# EAGLE schematic ESP Updater (EAGLE 9.6.2)
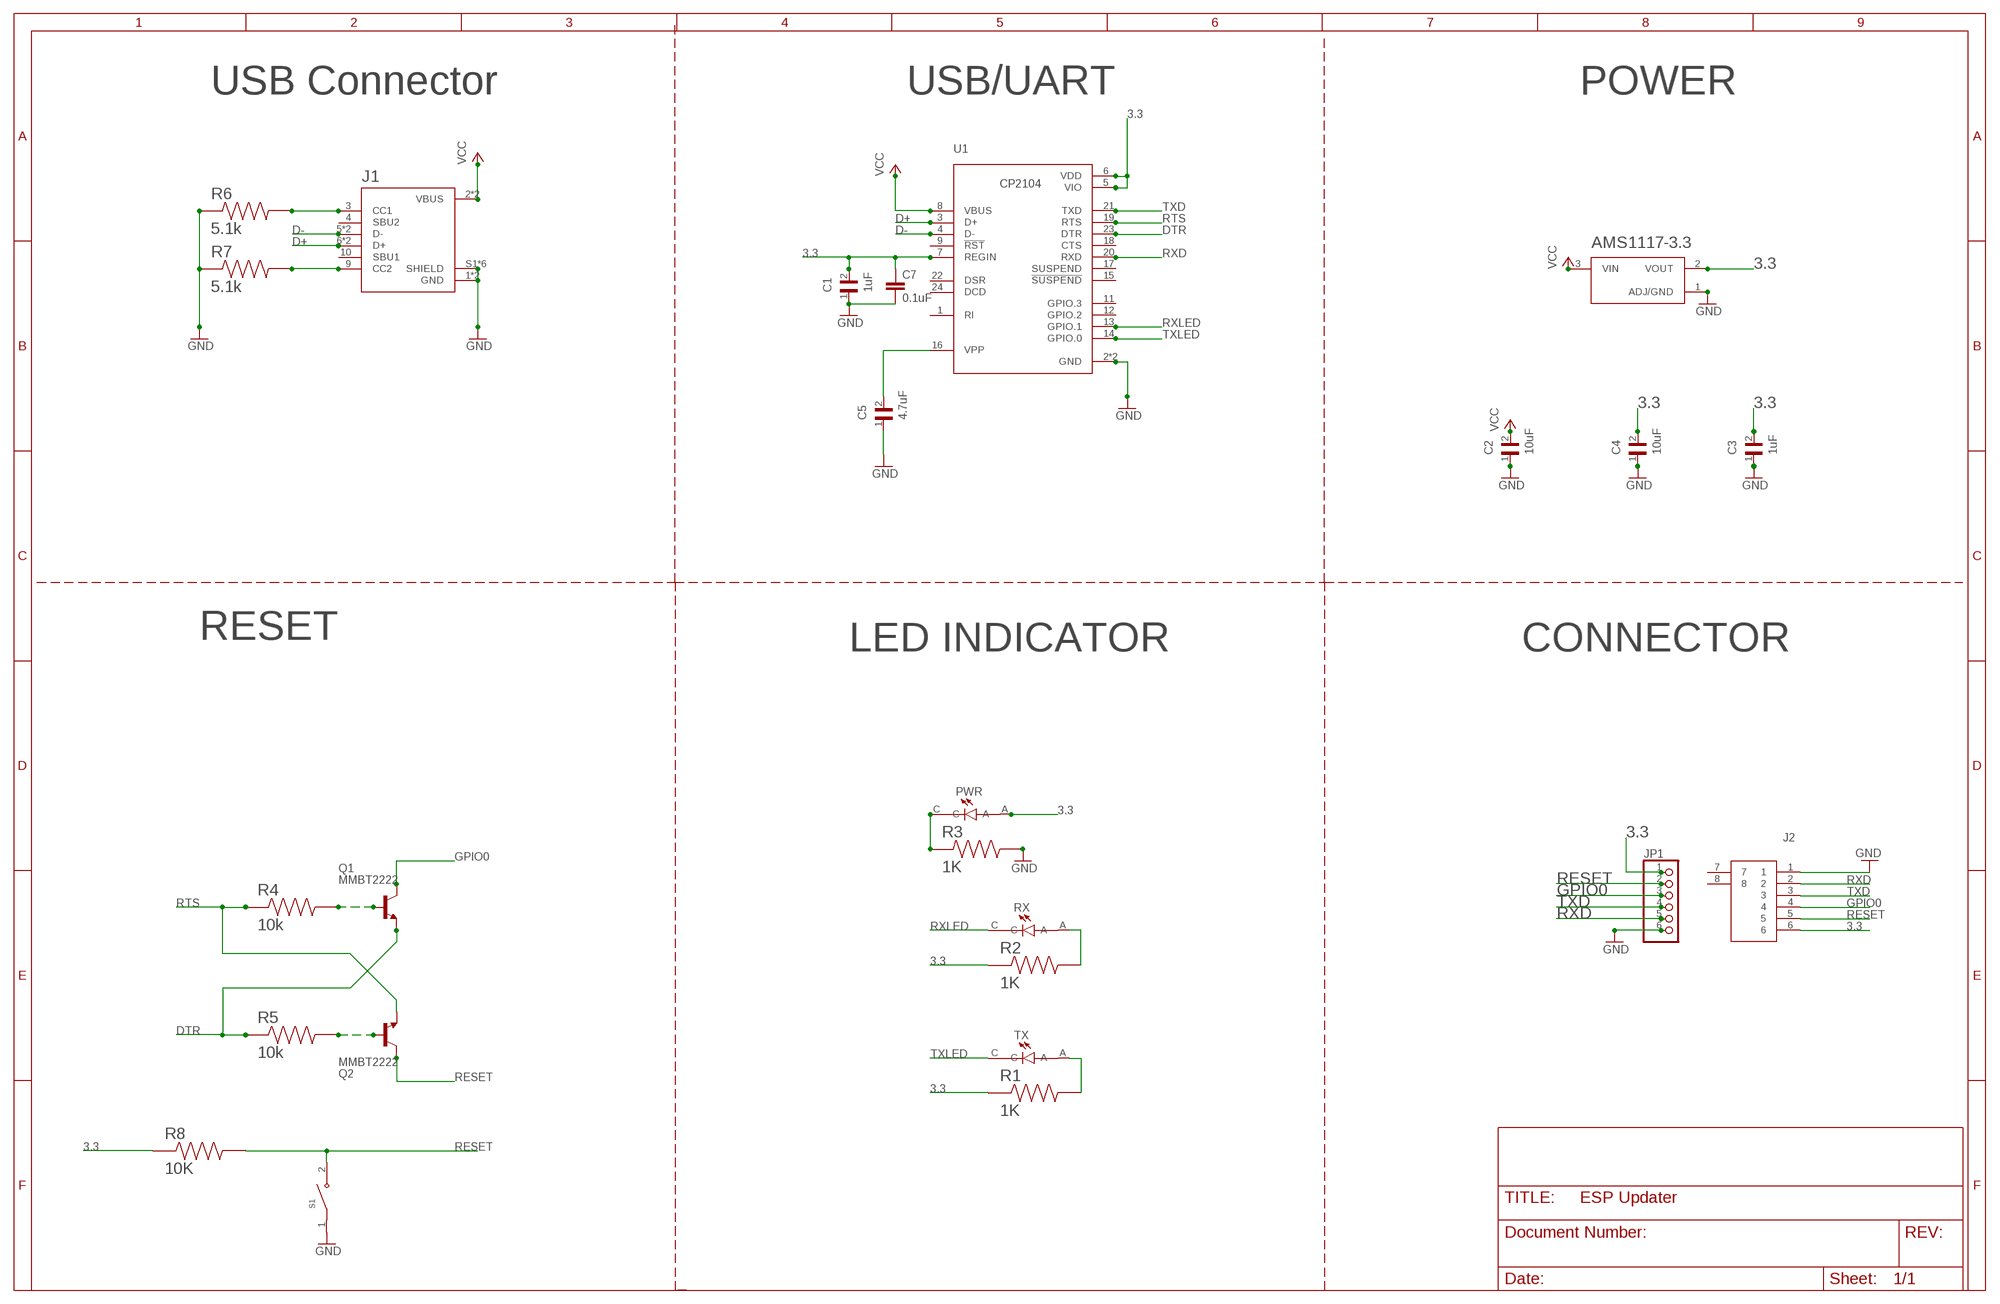
[diagram p0: schematic, sheet 1]

## Parts
C1  1uF  0805YC103J4T2A  [CAPC2012X94N]
C2  10uF  0805YC103J4T2A  [CAPC2012X94N]
C3  1uF  0805YC103J4T2A  [CAPC2012X94N]
C4  10uF  0805YC103J4T2A  [CAPC2012X94N]
C5  4.7uF  0805YC103J4T2A  [CAPC2012X94N]
C7  0.1uF  C-EUC0603  [C0603]
J1  DX07S016JA1R1500  [JAE_DX07S016JA1R1500]
J2  52852-0670  [528520670]
JP1  PINHD-1X6  [1X06]
PWR  SML-LXT0805IW-TR  [LEDC2012X120N]
Q1  MMBT2222  [SOT23-BEC]
Q2  MMBT2222  [SOT23-BEC]
R1  1K  RC0805FR-07330RL  [RESC2012X60N]
R2  1K  RC0805FR-07330RL  [RESC2012X60N]
R3  1K  RC0805FR-07330RL  [RESC2012X60N]
R4  10k  RC0805FR-07330RL  [RESC2012X60N]
R5  10k  RC0805FR-07330RL  [RESC2012X60N]
R6  5.1k  RC0805FR-07330RL  [RESC2012X60N]
R7  5.1k  RC0805FR-07330RL  [RESC2012X60N]
R8  10K  RC0805FR-07330RL  [RESC2012X60N]
RX  SML-LXT0805IW-TR  [LEDC2012X120N]
S1  PTS636_SM43J_SMTR_LFS  [SW_PTS636_SM43J_SMTR_LFS]
TX  SML-LXT0805IW-TR  [LEDC2012X120N]
U1  CP2104  CP2104-F03-GM  [QFN50P400X400X80-25N]
U2  AMS1117-3.3  [SOT229P700X180-4N]

## Nets
3.3: C1.2 C3.2 C4.2 C7.1 J2.6 JP1.1 PWR.A R1.1 R2.1 R8.1 U1.5(VIO) U1.6(VDD) U1.7(REGIN) U2.2(VOUT)
D+: J1.6(D+) J1.7(D+) U1.3(D+)
D-: J1.5(D-) J1.8(D-) U1.4(D-)
DTR: Q1.E R5.1 U1.23(DTR)
GND: C1.1 C2.1 C3.1 C4.1 C5.1 C7.2 J1.1(GND) J1.12(GND) J1.S1(SHIELD) J1.S2(SHIELD) J1.S3(SHIELD) J1.S4(SHIELD) J1.S5(SHIELD) J1.S6(SHIELD) J2.1 JP1.6 R3.2 R6.1 R7.1 S1.1(COM) U1.2(GND) U1.25(GND) U2.1(ADJ/GND)
GPIO0: J2.4 JP1.3 Q1.C
N$1: J1.3(CC1) R6.2
N$2: J1.9(CC2) R7.2
N$3: PWR.C R3.1
N$4: R2.2 RX.A
N$5: R1.2 TX.A
N$6: Q2.B R5.2
N$7: Q1.B R4.2
N$8: C5.2 U1.16(VPP)
RESET: J2.5 JP1.2 Q2.C R8.2 S1.2(NO)
RTS: Q2.E R4.1 U1.19(RTS)
RXD: J2.2 JP1.5 U1.20(RXD)
RXLED: RX.C U1.13(GPIO.1)
TXD: J2.3 JP1.4 U1.21(TXD)
TXLED: TX.C U1.14(GPIO.0)
VCC: C2.2 J1.2(VBUS) J1.11(VBUS) U1.8(VBUS) U2.3(VIN)
Unconnected: J1.4(SBU2) J1.10(SBU1) J2.7 J2.8 U1.1(RI) U1.9(!RST) U1.11(GPIO.3) U1.12(GPIO.2) U1.15(!SUSPEND) U1.17(SUSPEND) U1.18(CTS) U1.22(DSR) U1.24(DCD)

## Notes on the sheet
- USB Connector | USB/UART | POWER
- RESET | LED INDICATOR | CONNECTOR

## Library data of the parts
C1-C5 = 0805YC103J4T2A:0805YC103J4T2A: Cap Ceramic 0.01uF 16V X7R 5% SMD 0805 125°C Paper T/R Check availability <https://pricing.snapeda.com/parts/0805YC103J4T2A/AVX/view-part?ref=eda>; AVAILABILITY: In Stock; DESCRIPTION: 10000 pF ±5% 16V Ceramic Capacitor X7R 0805 (2012 Metric); MF: AVX; MP: 0805YC103J4T2A; PACKAGE: 2012 AVX; PRICE: None; PURCHASE-URL: https://pricing.snapeda.com/search/part/0805YC103J4T2A/?ref=eda
C7 = rcl:C-EU: CAPACITOR, European symbol; SPICEPREFIX: C
J1 = DX07S016JA1R1500:DX07S016JA1R1500: USB-C (USB TYPE-C) USB 2.0 Receptacle Connector 24 (16+8 Dummy) Position Surface Mount, Right Angle; Through Hole Check availability <https://pricing.snapeda.com/parts/DX07S016JA1R1500/JAE%20Electronics/view-part?ref=eda>; AVAILABILITY: In Stock; DESCRIPTION: USB-C (USB TYPE-C) USB 2.0 Receptacle Connector 24 (16+8 Dummy) Position Surface Mount, Right Angle; Through Hole; MF: JAE Electronics; MP: DX07S016JA1R1500; PACKAGE: None; PRICE: None; PURCHASE-URL: https://pricing.snapeda.com/search/part/DX07S016JA1R1500/?ref=eda
J2 = 52852-0670:52852-0670: FFC & FPC Connectors 1.0 FFC Non ZIF SMT HsgAssy6CktEmbsTpPkg Source: Datasheet <https://www.molex.com/pdm_docs/sd/528520670_sd.pdf>; DESCRIPTION: FFC & FPC Connectors 1.0 FFC Non ZIF SMT HsgAssy6CktEmbsTpPkg; HEIGHT: 3mm; MANUFACTURER_NAME: Molex; MANUFACTURER_PART_NUMBER: 52852-0670; MOUSER_PART_NUMBER: 538-52852-0670; MOUSER_PRICE-STOCK: https://www.mouser.co.uk/ProductDetail/Molex/52852-0670?qs=%252BdbFUiYBkDZQc5IPgvIwgQ%3D%3D
JP1 = pinhead:PINHD-1X6: PIN HEADER
PWR RX TX = SML-LXT0805IW-TR:SML-LXT0805IW-TR: LED; Luminous Intensity:11µcd; Viewing Angle:140°; Forward Current:30mA; Forward Voltage:2V; Color:Red; LED Color:Red; Leaded Process Compatible:Yes; Lens Color:White; Mounting Type:Surface Mount ;RoHS Compliant: Yes Check availability <https://pricing.snapeda.com/parts/SML-LXT0805IW-TR/Lumex%20Opto/Components/view-part?ref=eda>; AVAILABILITY: In Stock; DESCRIPTION: Red - LED Indication - Discrete 2V 0805 (2012 Metric); MF: Lumex Opto/Components; MP: SML-LXT0805IW-TR; PACKAGE: 0805 Lumex; PRICE: None; PURCHASE-URL: https://pricing.snapeda.com/search/part/SML-LXT0805IW-TR/?ref=eda
Q1 Q2 = MMBT2222_:MMBT2222*: NPN Transistor Check availability <https://pricing.snapeda.com/parts/MMBT2222/ON%20Semiconductor/view-part?ref=eda>; AVAILABILITY: In Stock; DESCRIPTION: Bipolar (BJT) Transistor NPN 30 V 600 mA 250MHz 300 mW Surface Mount SOT-23-3 (TO-236); MF: ON Semiconductor; MP: MMBT2222; PACKAGE: SOT-23-3 Fairchild Semiconductor; PRICE: None; PURCHASE-URL: https://pricing.snapeda.com/search/part/MMBT2222/?ref=eda
R1-R8 = RC0805FR-07330RL:RC0805FR-07330RL: Resistor SMD [YAGEO] RC0805FR-07330RL Resistor SMD Check availability <https://pricing.snapeda.com/parts/RC0805FR-07330RL/Yageo/view-part?ref=eda>; AVAILABILITY: In Stock; DESCRIPTION: 330 Ohms ±1% 0.125W, 1/8W Chip Resistor 0805 (2012 Metric) Moisture Resistant Thick Film; MF: Yageo; MP: RC0805FR-07330RL; PACKAGE: 2012 Rohm Semiconductor; PRICE: None; PURCHASE-URL: https://pricing.snapeda.com/search/part/RC0805FR-07330RL/?ref=eda
S1 = PTS636_SM43J_SMTR_LFS:PTS636_SM43J_SMTR_LFS: Tactile Switch SPST-NO Top Actuated Surface Mount Check availability <https://pricing.snapeda.com/parts/PTS636%20SM43J%20SMTR%20LFS/C%26K/view-part?ref=eda>; AVAILABILITY: In Stock; DESCRIPTION: Tactile Switch SPST-NO Top Actuated Surface Mount; MF: C&K; MP: PTS636 SM43J SMTR LFS; PACKAGE: None; PRICE: None; PURCHASE-URL: https://pricing.snapeda.com/search/part/PTS636 SM43J SMTR LFS/?ref=eda
U1 = CP2104-F03-GM:CP2104-F03-GM: USB-to-UART 1-CH 576byte FIFO 3.3V 24-Pin QFN EP T/R Check availability <https://pricing.snapeda.com/parts/CP2104-F03-GM/Silicon%20Labs/view-part?ref=eda>; AVAILABILITY: In Stock; DESCRIPTION: USB Bridge, USB to UART USB 2.0 UART Interface 24-QFN (4x4); MF: Silicon Labs; MP: CP2104-F03-GM; PACKAGE: WFQFN-24 Silicon Labs; PRICE: None; PURCHASE-URL: https://pricing.snapeda.com/search/part/CP2104-F03-GM/?ref=eda
U2 = AMS1117-3.3:AMS1117-3.3: Sot223/Pkg 1-Amp 3.3-Volt Low Drop Out Voltage Regulatator Check availability <https://pricing.snapeda.com/parts/AMS1117-3.3/Advanced%20Monolithic%20Systems/view-part?ref=eda>; AVAILABILITY: Not in stock; DESCRIPTION: LDO Voltage Regulators 800MA LDO LINEAR REG; MF: Advanced Monolithic Systems; MP: AMS1117-3.3; PACKAGE: SOT-223 Seeed Technology; PRICE: None